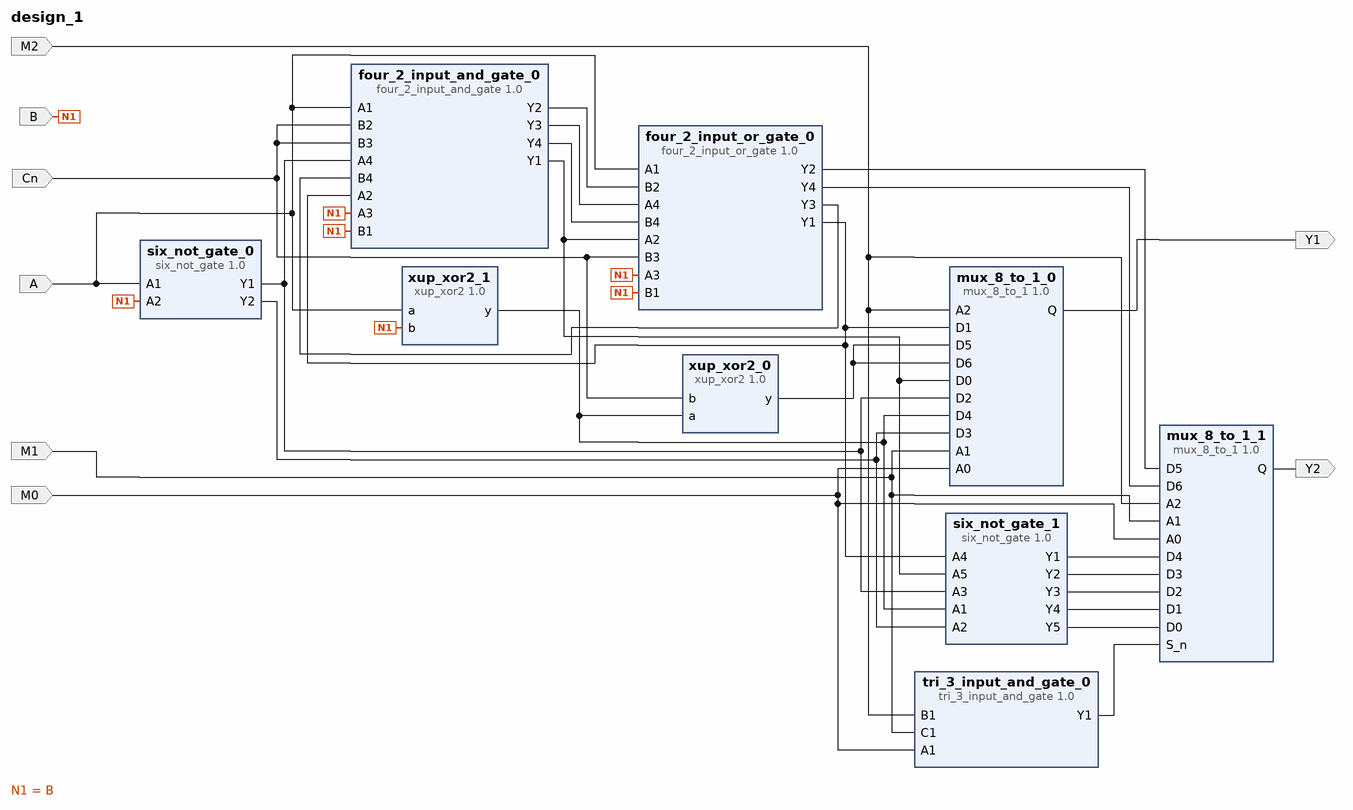
[diagram p0: block diagram of the top level]
# Vivado block design design_1, Vivado 2015.4
create_bd_design design_1

create_bd_port -dir I M2
create_bd_port -dir I M1
create_bd_port -dir I M0
create_bd_port -dir I A
create_bd_port -dir I B
create_bd_port -dir I Cn
create_bd_port -dir O Y1
create_bd_port -dir O Y2

create_bd_cell -type ip -vlnv xilinx.com:xup:mux_8_to_1:1.0 mux_8_to_1_0
create_bd_cell -type ip -vlnv xilinx.com:XUP:six_not_gate:1.0 six_not_gate_0
create_bd_cell -type ip -vlnv xilinx.com:XUP:four_2_input_and_gate:1.0 four_2_input_and_gate_0
create_bd_cell -type ip -vlnv xilinx.com:XUP:four_2_input_or_gate:1.0 four_2_input_or_gate_0
create_bd_cell -type ip -vlnv xilinx.com:xup:mux_8_to_1:1.0 mux_8_to_1_1
create_bd_cell -type ip -vlnv xilinx.com:XUP:six_not_gate:1.0 six_not_gate_1
create_bd_cell -type ip -vlnv xilinx.com:XUP:tri_3_input_and_gate:1.0 tri_3_input_and_gate_0
create_bd_cell -type ip -vlnv xilinx.com:xup:xup_xor2:1.0 xup_xor2_0
create_bd_cell -type ip -vlnv xilinx.com:xup:xup_xor2:1.0 xup_xor2_1

# ---- connections ----

connect_bd_net -net A2_1 [get_bd_ports M2] [get_bd_pins mux_8_to_1_0/A2] [get_bd_pins mux_8_to_1_1/A2] [get_bd_pins tri_3_input_and_gate_0/B1]
connect_bd_net -net A1_1 [get_bd_ports M1] [get_bd_pins mux_8_to_1_0/A1] [get_bd_pins mux_8_to_1_1/A1] [get_bd_pins tri_3_input_and_gate_0/C1]
connect_bd_net -net A0_1 [get_bd_ports M0] [get_bd_pins mux_8_to_1_0/A0] [get_bd_pins mux_8_to_1_1/A0] [get_bd_pins tri_3_input_and_gate_0/A1]
connect_bd_net [get_bd_ports A] \
  [get_bd_pins six_not_gate_0/A1] [get_bd_pins four_2_input_and_gate_0/A1] [get_bd_pins four_2_input_or_gate_0/A1] \
  [get_bd_pins xup_xor2_1/a]
connect_bd_net [get_bd_ports B] \
  [get_bd_pins six_not_gate_0/A2] [get_bd_pins four_2_input_and_gate_0/B1] [get_bd_pins four_2_input_or_gate_0/B1] \
  [get_bd_pins four_2_input_and_gate_0/A3] [get_bd_pins four_2_input_or_gate_0/A3] [get_bd_pins xup_xor2_1/b]
connect_bd_net [get_bd_pins six_not_gate_0/Y1] [get_bd_pins mux_8_to_1_0/D2] [get_bd_pins four_2_input_and_gate_0/A4] [get_bd_pins six_not_gate_1/A3]
connect_bd_net [get_bd_pins six_not_gate_0/Y2] [get_bd_pins mux_8_to_1_0/D3] [get_bd_pins six_not_gate_1/A2]
connect_bd_net [get_bd_pins four_2_input_and_gate_0/Y1] \
  [get_bd_pins mux_8_to_1_0/D0] [get_bd_pins four_2_input_or_gate_0/A2] [get_bd_pins six_not_gate_1/A5]
connect_bd_net [get_bd_ports Cn] \
  [get_bd_pins four_2_input_and_gate_0/B2] [get_bd_pins four_2_input_and_gate_0/B3] [get_bd_pins four_2_input_or_gate_0/B3] \
  [get_bd_pins xup_xor2_0/b]
connect_bd_net [get_bd_pins mux_8_to_1_0/Q] [get_bd_ports Y1]
connect_bd_net [get_bd_pins mux_8_to_1_1/Q] [get_bd_ports Y2]
connect_bd_net [get_bd_pins four_2_input_and_gate_0/Y2] [get_bd_pins four_2_input_or_gate_0/B2]
connect_bd_net [get_bd_pins four_2_input_or_gate_0/Y2] [get_bd_pins mux_8_to_1_1/D5]
connect_bd_net [get_bd_pins four_2_input_and_gate_0/Y3] [get_bd_pins four_2_input_or_gate_0/A4]
connect_bd_net [get_bd_pins four_2_input_and_gate_0/Y4] [get_bd_pins four_2_input_or_gate_0/B4]
connect_bd_net [get_bd_pins four_2_input_or_gate_0/Y3] [get_bd_pins four_2_input_and_gate_0/B4]
connect_bd_net [get_bd_pins four_2_input_or_gate_0/Y4] [get_bd_pins mux_8_to_1_1/D6]
connect_bd_net [get_bd_pins six_not_gate_1/Y1] [get_bd_pins mux_8_to_1_1/D4]
connect_bd_net [get_bd_pins six_not_gate_1/Y2] [get_bd_pins mux_8_to_1_1/D3]
connect_bd_net [get_bd_pins six_not_gate_1/Y3] [get_bd_pins mux_8_to_1_1/D2]
connect_bd_net [get_bd_pins six_not_gate_1/Y4] [get_bd_pins mux_8_to_1_1/D1]
connect_bd_net [get_bd_pins six_not_gate_1/Y5] [get_bd_pins mux_8_to_1_1/D0]
connect_bd_net [get_bd_pins four_2_input_or_gate_0/Y1] \
  [get_bd_pins mux_8_to_1_0/D1] [get_bd_pins four_2_input_and_gate_0/A2] [get_bd_pins six_not_gate_1/A4]
connect_bd_net [get_bd_pins tri_3_input_and_gate_0/Y1] [get_bd_pins mux_8_to_1_1/S_n]
connect_bd_net -net xup_xnor2_1_y [get_bd_pins xup_xor2_0/y] [get_bd_pins mux_8_to_1_0/D5] [get_bd_pins mux_8_to_1_0/D6]
connect_bd_net -net xup_xnor2_0_y [get_bd_pins xup_xor2_1/y] [get_bd_pins mux_8_to_1_0/D4] [get_bd_pins six_not_gate_1/A1] [get_bd_pins xup_xor2_0/a]

validate_bd_design
save_bd_design
